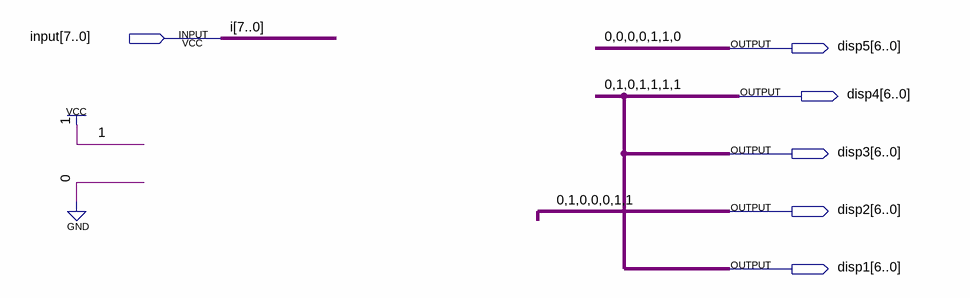
[diagram p0: schematic sheet]
// Quartus schematic ERROR.bdf as structural Verilog: 0 symbols, 6 pins
module ERROR (
  input  [7:0] \input ,
  output [6:0] disp5,
  output [6:0] disp4,
  output [6:0] disp3,
  output [6:0] disp2,
  output [6:0] disp1
);


  assign disp1 = 7'b0101111;
  assign disp2 = 7'b0100011;
  assign disp3 = 7'b0101111;
  assign disp4 = 7'b0101111;
  assign disp5 = 7'b0000110;

  // Other names for the same wires on the sheet: i[7:0] = \input 
endmodule
